# EAGLE schematic schematic (EAGLE 8.0.0)
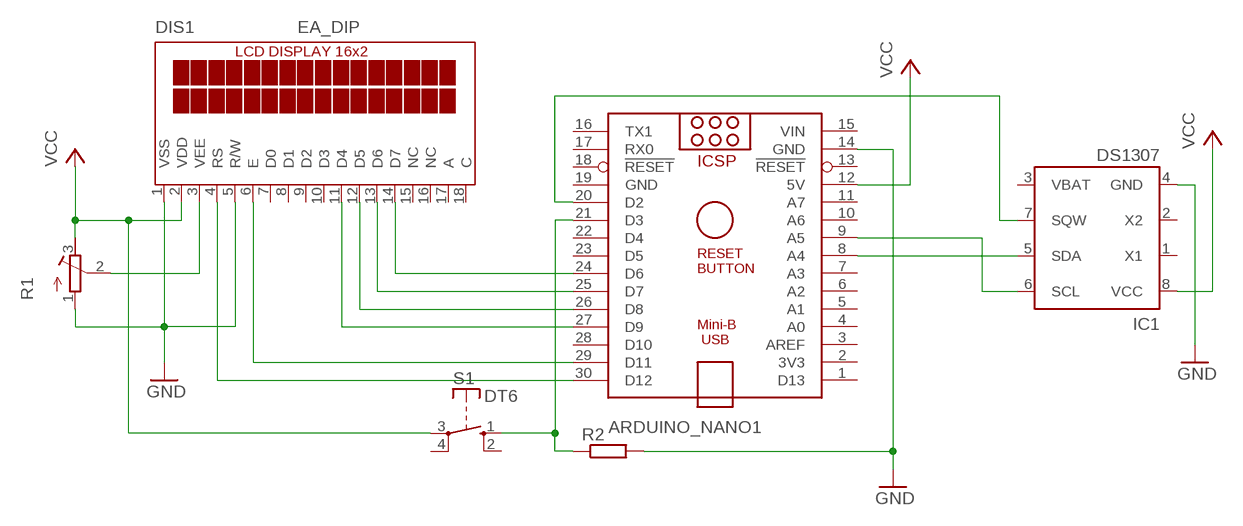
[diagram p0: schematic, sheet 1]

## Parts
ARDUINO_NANO1  ARDUINO_NANO  [ARDUINO_NANO]
DIS1  EA_DIP  [EA_DIP]
IC1  DS1307  [DIL08]
R1  R-TRIMMTS63Y  [RTRIMTS63Y]
R2  R-EU_0204/2V  [0204V]
S1  DT6  [DT6]

## Nets
GND: ARDUINO_NANO1.14(GND) DIS1.1(VSS) DIS1.5(R/W) IC1.4(GND) R1.1(A) R2.2
N$2: DIS1.3(VEE) R1.2(S)
N$4: ARDUINO_NANO1.30(D12) DIS1.4(RS)
N$6: ARDUINO_NANO1.29(D11) DIS1.6(E)
N$7: ARDUINO_NANO1.24(D6) DIS1.14(D7)
N$8: ARDUINO_NANO1.25(D7) DIS1.13(D6)
N$9: ARDUINO_NANO1.26(D8) DIS1.12(D5)
N$10: ARDUINO_NANO1.27(D9) DIS1.11(D4)
N$13: ARDUINO_NANO1.20(D2) IC1.7(SQW)
N$14: ARDUINO_NANO1.8(A4) IC1.5(SDA)
N$15: ARDUINO_NANO1.9(A5) IC1.6(SCL)
N$16: ARDUINO_NANO1.21(D3) R2.1 S1.1(S)
VCC: ARDUINO_NANO1.12(5V) DIS1.2(VDD) IC1.8(VCC) R1.3(E) S1.3(P)
Unconnected: ARDUINO_NANO1.1(D13) ARDUINO_NANO1.2(3V3) ARDUINO_NANO1.3(AREF) ARDUINO_NANO1.4(A0) ARDUINO_NANO1.5(A1) ARDUINO_NANO1.6(A2) ARDUINO_NANO1.7(A3) ARDUINO_NANO1.10(A6) ARDUINO_NANO1.11(A7) ARDUINO_NANO1.13(!RESET) ARDUINO_NANO1.16(TX1) ARDUINO_NANO1.17(RX0) ARDUINO_NANO1.18(!RESET) ARDUINO_NANO1.22(D4) ARDUINO_NANO1.23(D5) ARDUINO_NANO1.28(D10) DIS1.7(D0) DIS1.8(D1) DIS1.9(D2) DIS1.10(D3) DIS1.15(NC) DIS1.16(NC) DIS1.17(A) DIS1.18(C) IC1.1(X1) IC1.2(X2) IC1.3(VBAT) S1.2(S) S1.4(P)

## Power pins joined to a net without a drawn wire
GND: ARDUINO_NANO1.19(GND)
VIN: ARDUINO_NANO1.15(VIN)

## Library data of the parts
ARDUINO_NANO1 = ArduinoNanoV30:ARDUINO_NANO: Arduino Nano V3.0 Overview: The Arduino Nano is a small, complete, and breadboard-friendly board based on the ATmega328 (Arduino Nano 3.x) or ATmega168 (Arduino Nano 2.x). It has more or less the same functionality of the Arduino Duemilanove, but in a different package. It lacks only a DC power jack, and works with a Mini-B USB cable instead of a standard one. The Nano was designed and is being produced by Gravitech. Specifications: Microcontroller Atmel ATmega168 or ATmega328 Operating Voltage (logic level) 5 V Input Voltage (recommended) 7-12 V Input Voltage (limits) 6-20 V Digital I/O Pins 14 (of which 6 provide PWM output) Analog Input Pins 8 DC Current per I/O Pin 40 mA Flash Memory 16 KB (ATmega168) or 32 KB (ATmega328) of which 2 KB used by bootloader SRAM 1 KB (ATmega168) or 2 KB (ATmega328) EEPROM 512 bytes (ATmega168) or 1 KB (ATmega328) Clock Speed 16 MHz Dimensions 0.73" x 1.70" Length 45 mm Width 18 mm Weigth 5 g Power: The Arduino Nano can be powered via the Mini-B USB connection, 6-20V unregulated external power supply (pin 30), or 5V regulated external power supply (pin 27). The power source is automatically selected to the highest voltage source. Memory: The ATmega168 has 16 KB of flash memory for storing code (of which 2 KB is used for the bootloader); the ATmega328 has 32 KB, (also with 2 KB used for the bootloader). The ATmega168 has 1 KB of SRAM and 512 bytes of EEPROM (which can be read and written with the EEPROM library); the ATmega328 has 2 KB of SRAM and 1 KB of EEPROM. Input and Output: Each of the 14 digital pins on the Nano can be used as an input or output, using pinMode(), digitalWrite(), and digitalRead() functions. They operate at 5 volts. Each pin can provide or receive a maximum of 40 mA and has an internal pull-up resistor (disconnected by default) of 20-50 kOhms. In addition, some pins have specialized functions. Visit Arduino - ArduinoBoardNano <https://www.arduino.cc/en/Main/ArduinoBoardNano>
DIS1 = display-lcd:EA_DIP: LCD-MODUL 2x16 - 6,68mm, INKL. KONTROLLER HD44780 Source: Data sheet <http://www.lcd-module.de/pdf/doma/dip162-d.pdf>
IC1 = ds1307_pcf8583:DS1307: I2C-Bus CLOCK/CALENDAR
R1 = rcl:R-TRIMM: Trimm resistor
R2 = rcl:R-EU_: RESISTOR, European symbol
S1 = switch-misc:DT: ITT SWITCH